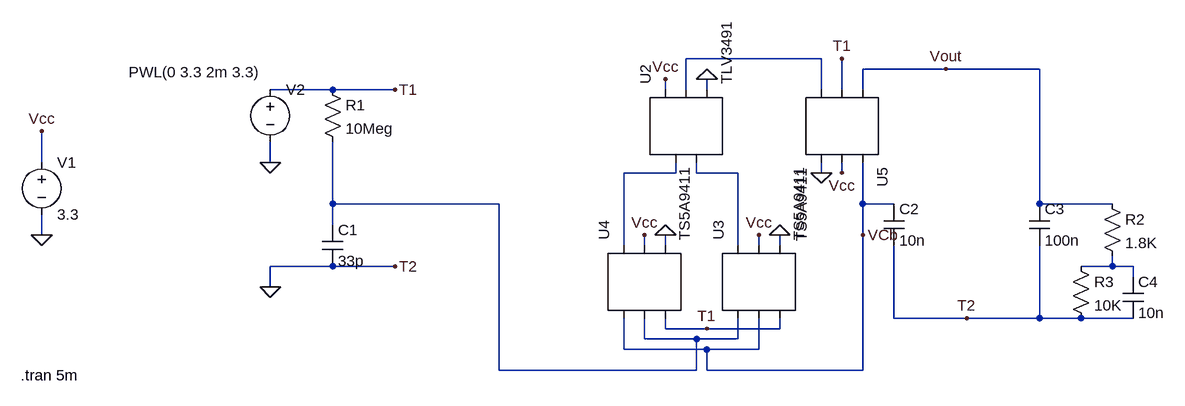
[diagram p0: schematic Draft3.asc]
Draft3.asc, the LTspice schematic file:
Version 4
SHEET 1 1272 680
WIRE 240 80 32 80
WIRE 432 96 304 96
WIRE 576 96 432 96
WIRE -512 128 -608 128
WIRE -416 128 -512 128
WIRE 0 128 0 112
WIRE 32 128 32 80
WIRE 64 128 64 112
WIRE 240 128 240 80
WIRE 272 128 272 80
WIRE 304 128 304 96
WIRE -960 240 -960 192
WIRE -608 240 -608 208
WIRE 16 256 16 240
WIRE 16 256 -64 256
WIRE 48 256 48 240
WIRE 112 256 48 256
WIRE 240 256 240 240
WIRE 272 256 272 240
WIRE -512 304 -512 208
WIRE -256 304 -512 304
WIRE 304 304 304 240
WIRE 352 304 304 304
WIRE 576 304 576 96
WIRE 688 304 576 304
WIRE -512 336 -512 304
WIRE -960 352 -960 320
WIRE 304 352 304 304
WIRE -64 368 -64 256
WIRE -32 368 -32 352
WIRE 0 368 0 352
WIRE 112 368 112 256
WIRE 144 368 144 352
WIRE 176 368 176 352
WIRE -512 400 -608 400
WIRE -416 400 -512 400
WIRE 688 400 688 384
WIRE 688 400 640 400
WIRE 720 400 688 400
WIRE 720 416 720 400
WIRE -608 432 -608 400
WIRE 352 480 352 368
WIRE 464 480 352 480
WIRE 576 480 576 368
WIRE 576 480 464 480
WIRE 640 480 576 480
WIRE 720 480 640 480
WIRE 0 496 0 480
WIRE 64 496 0 496
WIRE 176 496 176 480
WIRE 176 496 64 496
WIRE -32 512 -32 480
WIRE 48 512 -32 512
WIRE 112 512 112 480
WIRE 112 512 48 512
WIRE -64 528 -64 480
WIRE 64 528 -64 528
WIRE 144 528 144 480
WIRE 144 528 64 528
WIRE -256 560 -256 304
WIRE 48 560 48 512
WIRE 48 560 -256 560
WIRE 64 560 64 528
WIRE 304 560 304 352
WIRE 304 560 64 560
FLAG -960 352 0
FLAG -608 240 0
FLAG -608 432 0
FLAG -960 192 Vcc
FLAG 0 112 Vcc
FLAG 64 112 0
FLAG -32 352 Vcc
FLAG 144 352 Vcc
FLAG 0 352 0
FLAG 176 352 0
FLAG -416 128 T1
FLAG 64 496 T1
FLAG -416 400 T2
FLAG 304 352 VCb
FLAG 272 256 Vcc
FLAG 240 256 0
FLAG 272 80 T1
FLAG 432 96 Vout
FLAG 464 480 T2
SYMBOL res -528 112 R0
SYMATTR InstName R1
SYMATTR Value 10Meg
SYMBOL cap -528 336 R0
SYMATTR InstName C1
SYMATTR Value 33p
SYMBOL voltage -960 224 R0
WINDOW 123 0 0 Left 0
WINDOW 39 0 0 Left 0
SYMATTR InstName V1
SYMATTR Value 3.3
SYMBOL voltage -608 112 R0
WINDOW 3 -218 -11 Left 2
WINDOW 123 0 0 Left 0
WINDOW 39 0 0 Left 0
SYMATTR Value PWL(0 3.3 2m 3.3)
SYMATTR InstName V2
SYMBOL AutoGenerated\\TLV3491 32 208 R270
SYMATTR InstName U2
SYMBOL AutoGenerated\\TS5A9411 144 432 R270
SYMATTR InstName U3
SYMBOL AutoGenerated\\TS5A9411 -32 432 R270
SYMATTR InstName U4
SYMBOL AutoGenerated\\TS5A9411 272 176 R90
SYMATTR InstName U5
SYMBOL cap 336 304 R0
SYMATTR InstName C2
SYMATTR Value 10n
SYMBOL cap 560 304 R0
SYMATTR InstName C3
SYMATTR Value 100n
SYMBOL cap 704 416 R0
SYMATTR InstName C4
SYMATTR Value 10n
SYMBOL res 672 288 R0
SYMATTR InstName R2
SYMATTR Value 1.8K
SYMBOL res 624 384 R0
SYMATTR InstName R3
SYMATTR Value 10K
TEXT -992 568 Left 2 !.tran 5m

The netlist it stands for:
* Draft3.asc
R1 T1 N004 10Meg
C1 N004 0 33p
V1 Vcc 0 3.3
V2 T1 0 PWL(0 3.3 2m 3.3)
* U2: TLV3491 (symbol AutoGenerated\TLV3491 not available, pins judged from their places): pin1=N002 pin2=N003 pin3=Vcc pin4=N001 pin5=0
* U3: TS5A9411 (symbol AutoGenerated\TS5A9411 not available, pins judged from their places): pin1=N004 pin2=VCb pin3=T1 pin4=N003 pin5=Vcc pin6=0
* U4: TS5A9411 (symbol AutoGenerated\TS5A9411 not available, pins judged from their places): pin1=VCb pin2=N004 pin3=T1 pin4=N002 pin5=Vcc pin6=0
* U5: TS5A9411 (symbol AutoGenerated\TS5A9411 not available, pins judged from their places): pin1=Vout pin2=T1 pin3=N001 pin4=VCb pin5=Vcc pin6=0
C2 VCb 0 10n
C3 Vout 0 100n
C4 N005 0 10n
R2 Vout N005 1.8K
R3 N005 0 10K
.tran 5m
.backanno
.end